# EAGLE design Battery_board (EAGLE 7.5.0)
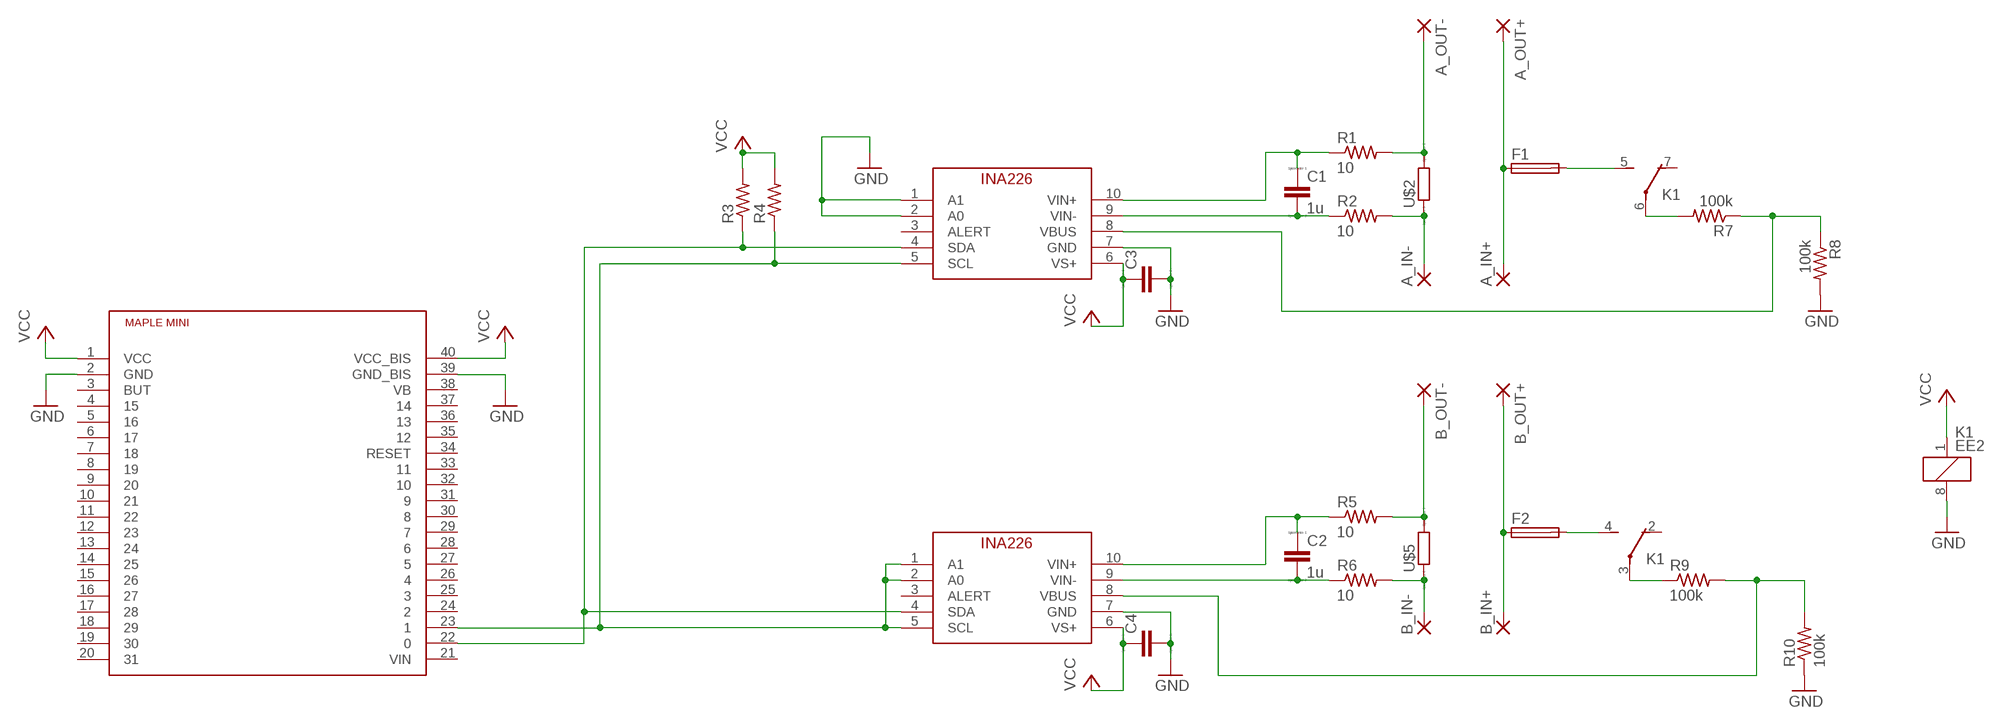
[diagram p0: schematic, sheet 1]

## Parts
A_IN+  WIREPAD4,16O1,6  [4,16O1,6]
A_IN-  WIREPAD4,16O1,6  [4,16O1,6]
A_OUT+  WIREPAD4,16O1,6  [4,16O1,6]
A_OUT-  WIREPAD4,16O1,6  [4,16O1,6]
B_IN+  WIREPAD4,16O1,6  [4,16O1,6]
B_IN-  WIREPAD4,16O1,6  [4,16O1,6]
B_OUT+  WIREPAD4,16O1,6  [4,16O1,6]
B_OUT-  WIREPAD4,16O1,6  [4,16O1,6]
C1  1u  CC0603  [C0603]
C2  1u  CC0603  [C0603]
C3  CC0603  [C0603]
C4  CC0603  [C0603]
F1  TE5  [TE5]
F2  TE5  [TE5]
K1  EE2  [EE2-5NU]
R1  10  R-US_R0603  [R0603]
R2  10  R-US_R0603  [R0603]
R3  R-US_R0603  [R0603]
R4  R-US_R0603  [R0603]
R5  10  R-US_R0603  [R0603]
R6  10  R-US_R0603  [R0603]
R7  100k  R-US_R1206  [R1206]
R8  100k  R-US_R1206  [R1206]
R9  100k  R-US_R1206  [R1206]
R10  100k  R-US_R1206  [R1206]
U$1  INA226  [MSOP10]
U$2  R_SHUNT_2526  [R2526]
U$3  MAPLE_MINI  [DIL40_MAPLE]
U$4  INA226  [MSOP10]
U$5  R_SHUNT_2526  [R2526]

## Nets
GND: C3.2 C4.2 K1.8 R8.2 R10.1 U$1.1(A1) U$1.2(A0) U$1.7(GND) U$3.2(GND) U$3.39(GND_BIS) U$4.7(GND)
N$1: R4.1 U$1.5(SCL) U$3.23 U$4.1(A1) U$4.2(A0) U$4.5(SCL)
N$2: C1.1 R1.1 U$1.10(VIN+)
N$3: C1.2 R2.1 U$1.9(VIN-)
N$4: F1.2 K1.5(3:S)
N$7: A_OUT-.1(P) R1.2 U$2.2
N$8: A_IN-.1(P) R2.2 U$2.1
N$9: A_IN+.1(P) A_OUT+.1(P) F1.1
N$10: F2.2 K1.4(2:S)
N$12: C2.1 R5.1 U$4.10(VIN+)
N$13: C2.2 R6.1 U$4.9(VIN-)
N$16: R3.1 U$1.4(SDA) U$3.22 U$4.4(SDA)
N$18: B_OUT-.1(P) R5.2 U$5.2
N$19: B_IN-.1(P) R6.2 U$5.1
N$20: B_IN+.1(P) B_OUT+.1(P) F2.1
N$21: K1.3(2:P) R9.1
N$22: R9.2 R10.2 U$4.8(VBUS)
N$23: K1.6(3:P) R7.2
N$24: R7.1 R8.1 U$1.8(VBUS)
VCC: C3.1 C4.1 K1.1 R3.2 R4.2 U$1.6(VS+) U$3.1(VCC) U$3.40(VCC_BIS) U$4.6(VS+)
Unconnected: K1.2(2:O) K1.7(3:O) U$1.3(ALERT) U$3.3(BUT) U$3.4 U$3.5 U$3.6 U$3.7 U$3.8 U$3.9 U$3.10 U$3.11 U$3.12 U$3.13 U$3.14 U$3.15 U$3.16 U$3.17 U$3.18 U$3.19 U$3.20 U$3.21(VIN) U$3.24 U$3.25 U$3.26 U$3.27 U$3.28 U$3.29 U$3.30 U$3.31 U$3.32 U$3.33 U$3.34(RESET) U$3.35 U$3.36 U$3.37 U$3.38(VB) U$4.3(ALERT)

## Library data of the parts
A_IN+ A_IN- A_OUT+ A_OUT- B_IN+ B_IN- B_OUT+ B_OUT- = wirepad:WIREPAD: Wire PAD connect wire on PCB
C1-C4 = eagle-ltspice:C: CAPACITOR, European symbol; SPICEMODEL: NONE; SPICEPREFIX: C
F1 F2 = fuse:TE5: FUSE Wickmann; OC_FARNELL: unknown; OC_NEWARK: unknown
K1 = CUSTOM:EE2: Compact & Slim 2 Form C Non-polarized Relay NAiS Source: http://www.mew-europe.com/.. en_ds_61011_0000.pdf
R1-R10 = resistor:R-US_: RESISTOR, American symbol
U$1 U$4 = CUSTOM:INA226: INA226
U$2 U$5 = CUSTOM:R_SHUNT_2526
U$3 = CUSTOM:MAPLE_MINI

## Board
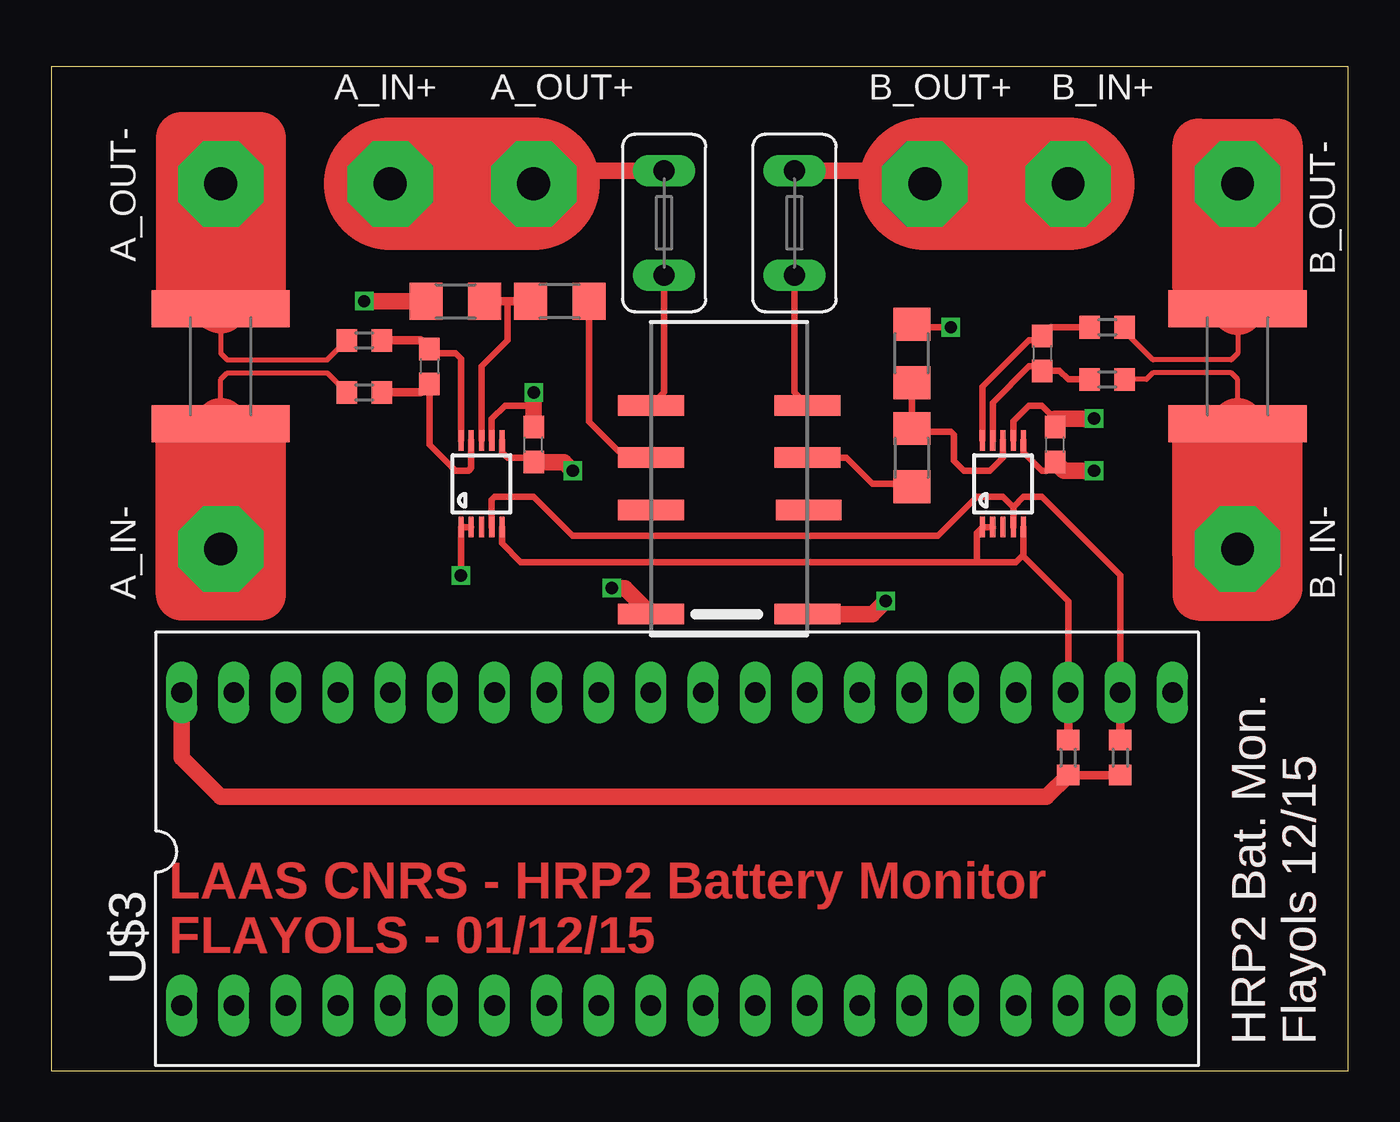
[diagram p1: board, top side]
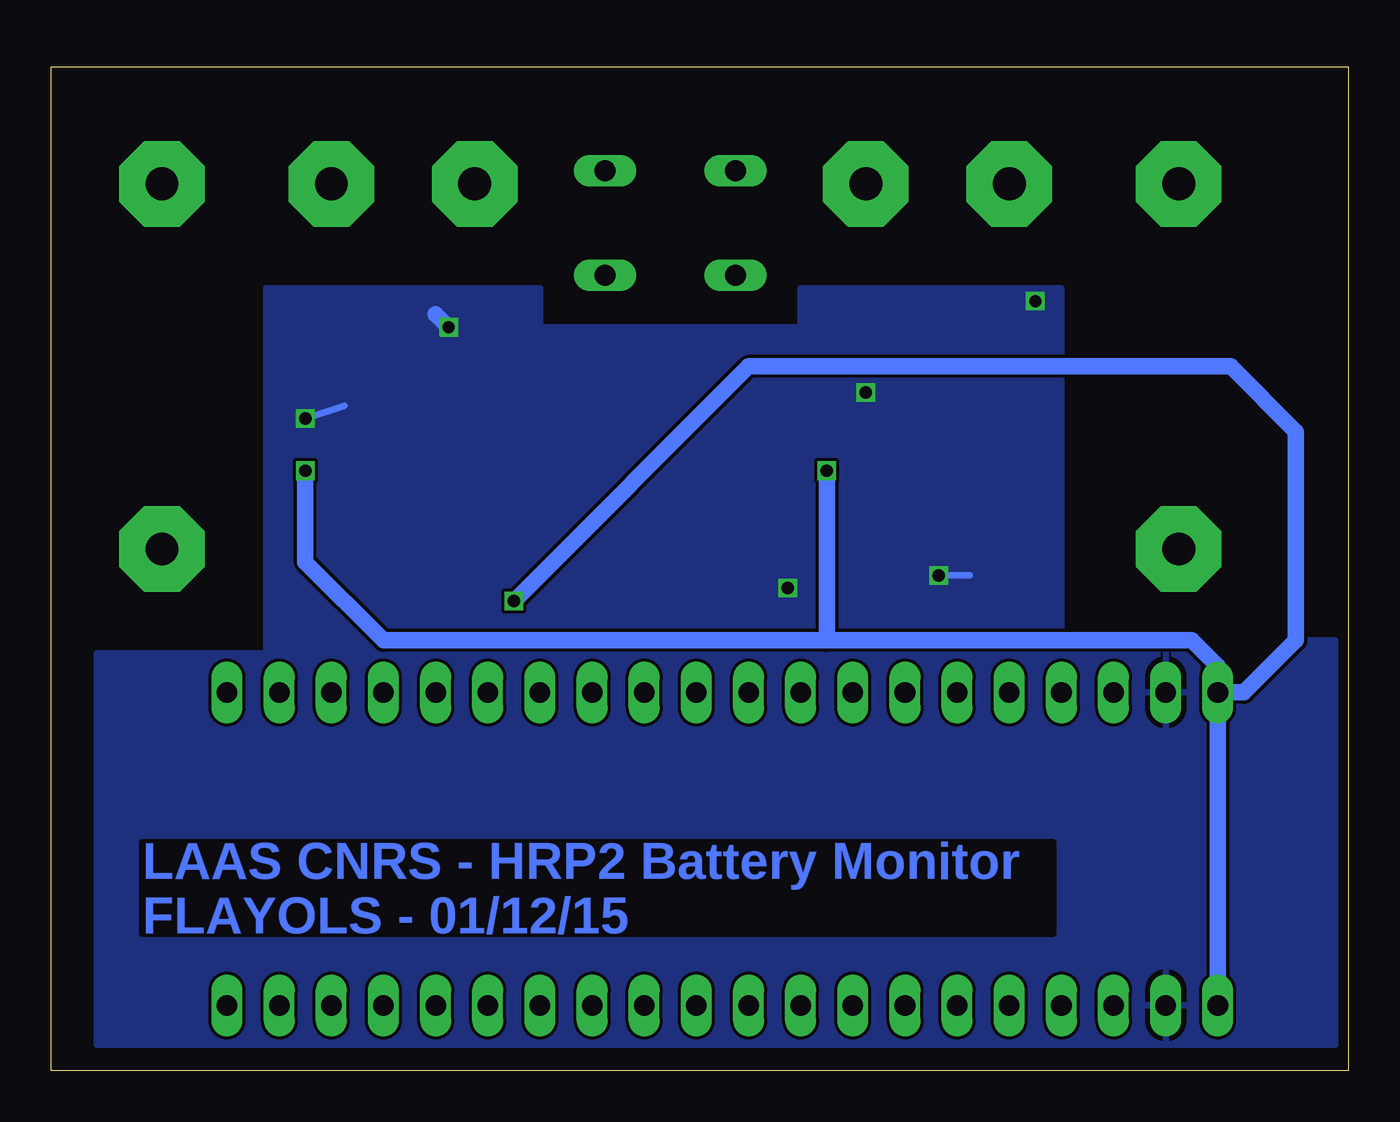
[diagram p2: board, bottom side, seen from below]

Size 63.17 x 48.88 mm. Coordinates in mm from the lower left corner, seen from the top.
Outline: 0,0 63.17,0 63.17,48.88 0,48.88 0,0
Copper layers (1*16): Top 0.035mm / dielectric 1.5mm / Bottom 0.035mm
Design rules "SeeedStudio_2layer_DRU_no_angle_20140221": minimum track width 6mil, minimum drill 12mil, track to track 6mil, track to pad 6mil, pad to pad 6mil, via to via 6mil, smd to smd 0mil, copper to edge 10mil, drill to drill 10mil, minimum pad ring 10mil, minimum via ring 6mil, stop-mask expansion 2mil, vias tented up to drill 100mil, thermal gap 10mil

### Footprints (pad centres in the part's own frame; a part is rotated, then mirrored left to right if it is on the bottom)
4,16O1,6 = drill 1.6 pad 4.166 octagon: 1 0,0
C0603 = smd 1.1 x 1: 1 -0.85,0; 2 0.85,0
TE5 = drill 1.016 long: 1 -2.54,0; 2 2.54,0
EE2-5NU = smd 1 x 3.2: 1 -5.08,-5.08; 2 0,-5.14; 3 2.54,-5.08; 4 5.08,-5.08; 5 5.08,2.54; 6 2.54,2.54; 7 0,2.54; 8 -5.08,2.54
R0603 = smd 1 x 1.1: 1 -0.85,0; 2 0.85,0
R1206 = smd 1.6 x 1.803: 1 -1.422,0; 2 1.422,0
MSOP10 = smd 0.25 x 1: 1 -1,-2.113; 2 -0.5,-2.113; 3 0,-2.113; 4 0.5,-2.113; 5 1,-2.113; 6 1,2.113; 7 0.5,2.113; 8 0,2.113; 9 -0.5,2.113; 10 -1,2.113
R2526 = smd 1.8 x 6.731: 1 -2.8,0; 2 2.8,0
DIL40_MAPLE = drill 1 long: 1 -24.13,-7.62; 2 -21.59,-7.62; 3 -19.05,-7.62; 4 -16.51,-7.62; 5 -13.97,-7.62; 6 -11.43,-7.62; 7 -8.89,-7.62; 8 -6.35,-7.62; 9 -3.81,-7.62; 10 -1.27,-7.62; 11 1.27,-7.62; 12 3.81,-7.62; 13 6.35,-7.62; 14 8.89,-7.62; 15 11.43,-7.62; 16 13.97,-7.62; 17 16.51,-7.62; 18 19.05,-7.62; 19 21.59,-7.62; 20 24.13,-7.62; 21 24.13,7.62; 22 21.59,7.62; 23 19.05,7.62; 24 16.51,7.62; 25 13.97,7.62; 26 11.43,7.62; 27 8.89,7.62; 28 6.35,7.62; 29 3.81,7.62; 30 1.27,7.62; 31 -1.27,7.62; 32 -3.81,7.62; 33 -6.35,7.62; 34 -8.89,7.62; 35 -11.43,7.62; 36 -13.97,7.62; 37 -16.51,7.62; 38 -19.05,7.62; 39 -21.59,7.62; 40 -24.13,7.62

### Placement (x,y rotation side)
A_IN+  16.51,43.18 0 top
A_IN-  8.25,25.4 270 top
A_OUT+  23.5,43.18 0 top
A_OUT-  8.25,43.18 270 top
B_IN+  49.53,43.18 0 top
B_IN-  57.78,25.4 270 top
B_OUT+  42.55,43.18 0 top
B_OUT-  57.78,43.18 270 top
C1  18.41,34.29 270 top
C2  48.26,34.92 270 top
C3  23.5,30.48 90 top
C4  48.9,30.48 90 top
F1  29.84,41.27 270 top
F2  36.2,41.27 270 top
K1  31.75,27.3 90 top
R1  15.24,35.56 180 top
R2  15.24,33.02 180 top
R3  52.07,15.24 270 top
R4  49.53,15.24 270 top
R5  51.44,36.2 0 top
R6  51.44,33.66 0 top
R7  24.77,37.47 0 top
R8  19.68,37.47 180 top
R9  41.91,29.84 90 top
R10  41.91,34.92 270 top
U$1  20.95,28.57 0 top
U$2  8.25,34.29 90 top
U$3  30.48,10.79 0 top
U$4  46.35,28.57 0 top
U$5  57.78,34.29 90 top

### Tracks (layer width: path | path; a pad name or v marks a point on that pad's centre or on a via)
GND  (via drill 0.6)
  Top 0.305: U$4.7 46.85,31.61 47.62,32.38 48.26,32.38 48.9,31.75 C4.2 | U$1.7 21.45,31.75 22.09,32.38 23.5,32.38 | U$1.2 U$1.1 v19.95,24.11 | R10.1 41.91,36.2 v43.81,36.2
  Top 0.813: R8.2 v15.24,37.47 | 48.9,31.75 v50.8,31.75 | v27.3,23.5 27.94,23.5 K1.8 | C3.2 23.5,32.38 v23.5,33.02
  Bottom 0.305: 48.9,32.38 v50.8,31.75 | v19.95,24.11 19.93,24.13 18.41,24.13
  Bottom 0.813: v43.81,36.2 44.45,36.83
  pour Bottom: 13.97,20.95 13.97,38.1 26.67,38.1 26.67,36.2 39.37,36.2 39.37,38.1 52.7,38.1 52.7,20.32 60.96,20.32 60.96,1.27 0.63,1.27 0.63,20.95
N$1
  Top 0.305: U$1.5 21.95,25.67 22.86,24.77 45.09,24.77 | 45.09,24.77 45.09,26.19 U$4.1 U$4.2 | U$3.23 49.53,22.86 47.35,25.04 47.35,25.13 | U$4.5 47.35,25.13 | 47.35,25.13 46.99,24.77 45.09,24.77
  Top 0.406: U$3.23 R4.1
N$2
  Top 0.305: U$1.10 19.95,34.66 19.68,34.92 18.63,34.92 C1.1
  Top 0.406: R1.1 18,35.56 C1.1
N$3
  Top 0.305: U$1.9 20.45,29.34 20.32,29.21 19.68,29.21 18.41,30.48 C1.2
  Top 0.406: R2.1 18,33.02 C1.2
N$4
  Top 0.305: F1.2 29.84,33.02 K1.5
N$7
  Top 0.254: 8.25,37.15 U$2.2 8.25,34.92 8.57,34.61 13.44,34.61 R1.2
  Top 0.406: 8.25,38.1 10.16,37.09 8.89,37.09 U$2.2 | R1.2 14.39,35.34
  Top 1.778: 10.16,37.78 8.89,38.1 8.89,37.09
  Top 2.54: 6.35,45.4 A_OUT-.1 8.25,37.15 7.62,37.47 6.35,37.47 6.35,45.4 | 10.16,37.78 10.16,45.4 6.35,45.4
N$8
  Top 0.254: U$2.1 8.25,33.66 8.57,33.97 13.44,33.97 R2.2
  Top 0.406: R2.2 14.39,33.23
  Top 2.54: A_IN-.1 6.98,25.4 6.35,23.18 | 6.35,23.18 6.35,31.11 8.25,31.11 | 8.89,30.48 8.25,31.11 | 8.25,31.11 A_IN-.1 | A_IN-.1 10.16,23.18 | 10.16,31.11 10.16,23.18 | 10.16,23.18 6.35,23.18 | 6.35,23.18 8.25,25.08 U$2.1
N$9
  Top 0.813: F1.1 24.13,43.81 A_OUT+.1
  Top 6.452: A_IN+.1 A_OUT+.1
N$10
  Top 0.305: F2.2 36.2,33.02 K1.4
N$12
  Top 0.305: R5.1 48.68,36.2 C2.1 48.05,35.56 47.62,35.56 45.35,33.29 U$4.10
N$13
  Top 0.305: U$4.9 45.85,32.52 47.62,34.29 48.05,34.29 C2.2 49.11,34.08 49.53,33.66 R6.1
N$16
  Top 0.305: U$1.4 21.45,27.8 21.59,27.94 23.5,27.94 25.4,26.04 43.18,26.04 45.09,27.94 46.35,27.94 46.85,27.44 | U$3.22 52.07,24.13 48.26,27.94 47.35,27.94 46.85,27.44 | 46.85,27.44 U$4.4
  Top 0.406: U$3.22 R3.1
N$18
  Top 0.254: 55.88,38.1 57.78,36.2 57.78,34.92 57.47,34.61 53.66,34.61 52.28,35.98 R5.2
  Top 2.54: 55.88,38.1 55.88,45.09 59.69,45.09 59.69,37.78 57.78,40.01 B_OUT-.1 U$5.2
N$19
  Top 0.254: 57.78,31.11 U$5.1 57.78,33.66 57.47,33.97 53.66,33.97 53.34,33.66 R6.2 | 55.88,31.11 56.26,31.49
  Top 2.54: 57.78,24.13 B_IN-.1 57.78,27.62 57.78,29.21 | 57.78,24.13 57.78,23.18 55.88,25.08 | 55.88,25.08 55.88,23.5 | 55.88,23.5 55.88,23.18 59.37,23.18 59.69,23.5 59.69,31.11 57.78,29.21 | 57.78,24.13 57.15,23.5 55.88,23.5 | 55.88,25.08 55.88,31.11 | U$5.1 57.78,29.21
N$20
  Top 0.813: 42.55,44.45 B_OUT+.1 41.91,43.81 F2.1
  Top 6.452: B_OUT+.1 B_IN+.1
N$21
  Top 0.305: K1.3 38.73,29.84 40.01,28.57 41.76,28.57 R9.1
N$22
  Top 0.305: U$4.8 46.35,29.84 45.72,29.21 44.45,29.21 43.97,29.69 43.97,30.96 43.81,31.11 42.06,31.11 R9.2 R10.2
N$23
  Top 0.305: R7.2 26.19,31.6 27.94,29.84 K1.6
N$24
  Top 0.305: U$1.8 20.95,34.29 22.23,35.56 22.23,37.47
  Top 0.406: R7.1 22.23,37.47 R8.1
VCC  (via drill 0.6)
  Top 0.305: U$4.6 47.35,30.11 48.26,29.21 48.48,29.21 C4.1 | C3.1 23.28,29.84 22.23,29.84 21.95,30.11 U$1.6
  Top 0.406: R4.2 R3.2
  Top 0.813: R4.2 48.48,13.34 8.25,13.34 6.35,15.24 U$3.40 | v25.4,29.21 24.98,29.63 C3.1 | C4.1 49.31,29.21 v50.8,29.21 | K1.1 40.01,22.23 v40.64,22.86
  Bottom 0.813: U$3.40 U$3.1 | 25.4,20.95 7.62,20.95 6.35,19.68 U$3.40 | 25.4,20.95 46.99,20.95 50.8,24.77 v50.8,29.21 | U$3.40 5.08,18.41 2.54,20.95 2.54,31.11 5.71,34.29 29.21,34.29 v40.64,22.86 | v25.4,29.21 25.4,20.95

### Text on the board
Top: LAAS CNRS - HRP2 Battery Monitor / FLAYOLS - 01/12/15 | HRP2 Bat. Mon. / Flayols 12/15 | HRP2 Bat. Mon. / Flayols 12/15
Bottom: LAAS CNRS - HRP2 Battery Monitor / FLAYOLS - 01/12/15
tPlace: HRP2 Bat. Mon. / Flayols 12/15